# EAGLE design RH001.1 (EAGLE 7.1.0)
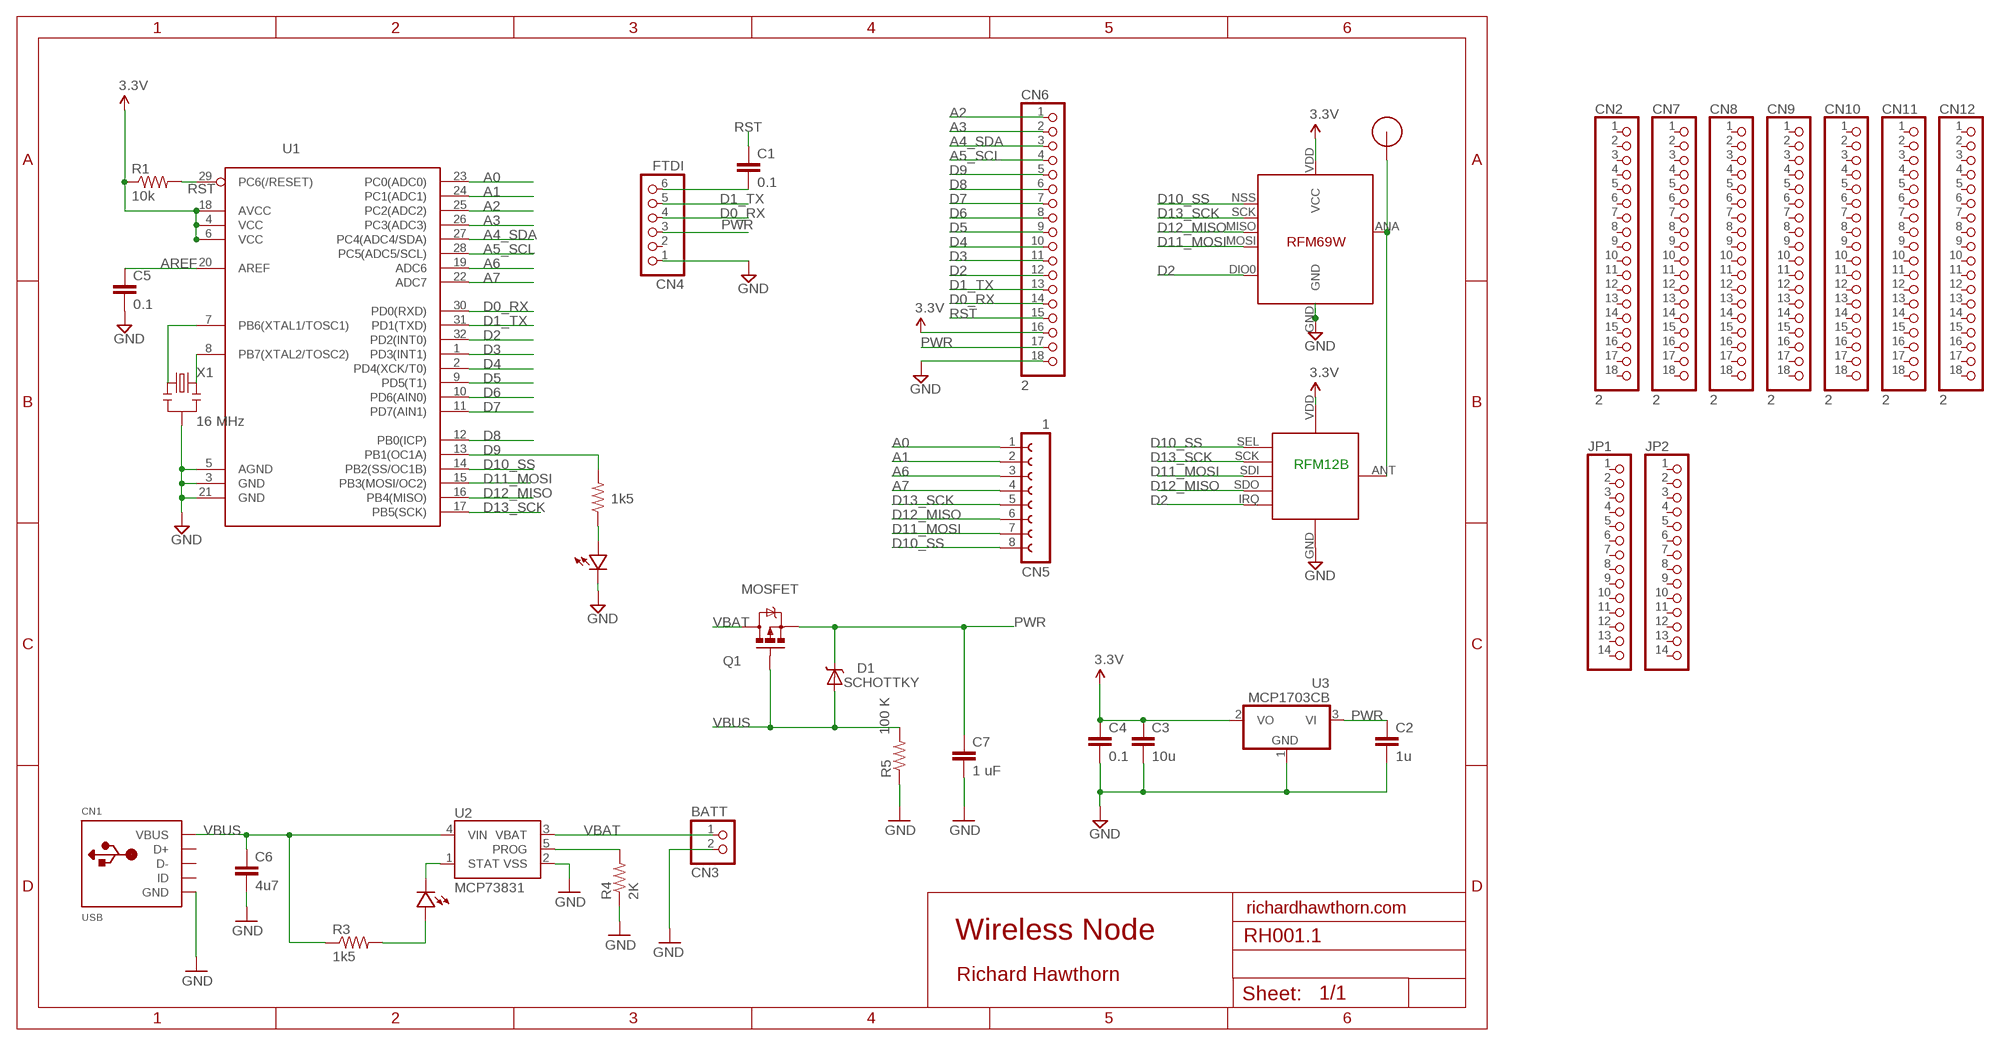
[diagram p0: schematic, sheet 1]

## Parts
C1  0.1  CAP0603-CAP  [0603-CAP]
C2  1u  CAP0603-CAP  [0603-CAP]
C3  10u  CAP0805-CAP  [0805-CAP]
C4  0.1  CAP0603-CAP  [0603-CAP]
C5  0.1  CAP0603-CAP  [0603-CAP]
C6  4u7  CAP0603-CAP  [0603-CAP]
C7  1 uF  CAP0805  [0805]
CN1  USB  USBMINIB  [USB-MINIB]
CN2  2  PINHD-1X18  [1X18]
CN3  BATT  JST_2PIN-SMT-RA  [JST-PH-2-SMT-RA]
CN4  FTDI  PINHD-1X6  [1X06]
CN5  1  FE08-1  [FE08]
CN6  2  PINHD-1X18  [1X18]
CN7  2  PINHD-1X18  [1X18]
CN8  2  PINHD-1X18  [1X18]
CN9  2  PINHD-1X18  [1X18]
CN10  2  PINHD-1X18  [1X18]
CN11  2  PINHD-1X18  [1X18]
CN12  2  PINHD-1X18  [1X18]
D1  SCHOTTKY  DIODE-SCHOTTKY_  [SMA-DIODE]
JP1  PINHD-1X14  [1X14]
JP2  PINHD-1X14  [1X14]
LED1  LED0603  [0603-LED]
LED2  LED0603  [0603-LED]
Q1  MOSFET  MOSFET-PCHANNELSMD  [SOT23-3]
R1  10k  RESISTOR0603-RES  [0603-RES]
R2  1k5  RESISTOR0603-RES  [0603-RES]
R3  1k5  RESISTOR0603-RES  [0603-RES]
R4  2K  RESISTOR0603-RES  [0603-RES]
R5  100 K  RESISTOR0805-RES  [0805]
RF1  RFM12B  RFM12B_MINPADS  [RFM12B-MINPADS]
RF2  RFM69  [RFM69W-MINPADS]
U1  ATMega-328  ATMEGA168/328TQFP32  [TQFP32-08]
U2  MCP73831  [SOT23-5]
U3  MCP1703CB  [SOT23]
U$1  RFM12B_ANTENNA  [RFM12B-ANTENNA]
X1  16 MHz  RESONATORSMD  [RESONATOR-SMD]

## Nets
A0: CN5.1 U1.23(PC0(ADC0))
A1: CN5.2 U1.24(PC1(ADC1))
A2: CN6.1 U1.25(PC2(ADC2))
A3: CN6.2 U1.26(PC3(ADC3))
A4_SDA: CN6.3 U1.27(PC4(ADC4/SDA))
A5_SCL: CN6.4 U1.28(PC5(ADC5/SCL))
A6: CN5.3 U1.19(ADC6)
A7: CN5.4 U1.22(ADC7)
AREF: C5.1 U1.20(AREF)
D0_RX: CN4.4 CN6.14 U1.30(PD0(RXD))
D1_TX: CN4.5 CN6.13 U1.31(PD1(TXD))
D2: CN6.12 RF1.IRQ RF2.DIO0 U1.32(PD2(INT0))
D3: CN6.11 U1.1(PD3(INT1))
D4: CN6.10 U1.2(PD4(XCK/T0))
D5: CN6.9 U1.9(PD5(T1))
D6: CN6.8 U1.10(PD6(AIN0))
D7: CN6.7 U1.11(PD7(AIN1))
D8: CN6.6 U1.12(PB0(ICP))
D9: CN6.5 R2.2 U1.13(PB1(OC1A))
D10_SS: CN5.8 RF1.SEL RF2.NSS(SEL) U1.14(PB2(SS/OC1B))
D11_MOSI: CN5.7 RF1.SDI(SDI/MOSI) RF2.MOSI U1.15(PB3(MOSI/OC2))
D12_MISO: CN5.6 RF1.SDO(SDO/MISO) RF2.MISO U1.16(PB4(MISO))
D13_SCK: CN5.5 RF1.SCK RF2.SCK U1.17(PB5(SCK))
GND [power]: C2.2 C3.2 C4.2 C5.2 C6.2 C7.2 CN1.GND CN3.2 CN4.1 CN6.18 LED2.MINUS R4.1 R5.1 RF1.GND RF2.GND U1.3(GND) U1.5(AGND) U1.21(GND) U2.2(VSS) U3.1(GND) X1.2
N$1: U1.7(PB6(XTAL1/TOSC1)) X1.1
N$2: LED2.PLUS R2.1
N$3: RF1.ANT RF2.ANA(ANT) U$1.P$1
N$4: LED1.PLUS R3.2
N$20: C1.2 CN4.6
N$21: U1.8(PB7(XTAL2/TOSC2)) X1.3
PROG: R4.2 U2.5(PROG)
PWR [power]: C2.1 C7.1 CN4.3 CN6.17 D1.C Q1.2(S) U3.3(VI)
RST: C1.1 CN6.15 R1.2 U1.29(PC6(/RESET))
STAT: LED1.MINUS U2.1(STAT)
VBAT: CN3.1 Q1.3(D) U2.3(VBAT)
VBUS [power]: C6.1 CN1.VBUS D1.A Q1.1(G) R3.1 R5.2 U2.4(VIN)
VCC: C3.1 C4.1 CN6.16 R1.1 RF1.VDD RF2.VDD(VCC) U1.4(VCC) U1.6(VCC) U1.18(AVCC) U3.2(VO) ; supply symbol labelled 3.3V
Unconnected: CN1.D+ CN1.D- CN1.ID CN2.1 CN2.2 CN2.3 CN2.4 CN2.5 CN2.6 CN2.7 CN2.8 CN2.9 CN2.10 CN2.11 CN2.12 CN2.13 CN2.14 CN2.15 CN2.16 CN2.17 CN2.18 CN4.2 CN7.1 CN7.2 CN7.3 CN7.4 CN7.5 CN7.6 CN7.7 CN7.8 CN7.9 CN7.10 CN7.11 CN7.12 CN7.13 CN7.14 CN7.15 CN7.16 CN7.17 CN7.18 CN8.1 CN8.2 CN8.3 CN8.4 CN8.5 CN8.6 CN8.7 CN8.8 CN8.9 CN8.10 CN8.11 CN8.12 CN8.13 CN8.14 CN8.15 CN8.16 CN8.17 CN8.18 CN9.1 CN9.2 CN9.3 CN9.4 CN9.5 CN9.6 CN9.7 CN9.8 CN9.9 CN9.10 CN9.11 CN9.12 CN9.13 CN9.14 CN9.15 CN9.16 CN9.17 CN9.18 CN10.1 CN10.2 CN10.3 CN10.4 CN10.5 CN10.6 CN10.7 CN10.8 CN10.9 CN10.10 CN10.11 CN10.12 CN10.13 CN10.14 CN10.15 CN10.16 CN10.17 CN10.18 CN11.1 CN11.2 CN11.3 CN11.4 CN11.5 CN11.6 CN11.7 CN11.8 CN11.9 CN11.10 CN11.11 CN11.12 CN11.13 CN11.14 CN11.15 CN11.16 CN11.17 CN11.18 CN12.1 CN12.2 CN12.3 CN12.4 CN12.5 CN12.6 CN12.7 CN12.8 CN12.9 CN12.10 CN12.11 CN12.12 CN12.13 CN12.14 CN12.15 CN12.16 CN12.17 CN12.18 JP1.1 JP1.2 JP1.3 JP1.4 JP1.5 JP1.6 JP1.7 JP1.8 JP1.9 JP1.10 JP1.11 JP1.12 JP1.13 JP1.14 JP2.1 JP2.2 JP2.3 JP2.4 JP2.5 JP2.6 JP2.7 JP2.8 JP2.9 JP2.10 JP2.11 JP2.12 JP2.13 JP2.14

## Notes on the sheet
- RFM12B
- richardhawthorn.com
- Wireless Node
- Richard Hawthorn

## Library data of the parts
C1-C5 = LowPowerLab:CAP: Capacitor Standard 0603 ceramic capacitor, and 0.1" leaded capacitor.
C6 = SparkFun:CAP: Capacitor Standard 0603 ceramic capacitor, and 0.1" leaded capacitor.
C7 = SparkFun-Capacitors:CAP: Capacitor Standard 0603 ceramic capacitor, and 0.1" leaded capacitor.
CN1 = LowPowerLab:USB: USB Connectors USBMINIB - Surface Mount Female Mini-B USB Connector 4UConnector: 06564 By microbuilder.eu Thru-hole RA Female Mini-B USB Connector 4UConnector: 18732 By ladyada.net
CN2 CN6-CN12 = pinhead:PINHD-1X18: PIN HEADER
CN3 = adafruit:JST_2PIN: JST 2-Pin Connectors of various flavors SMT-RA (S2B-PH-SM4) 4UConnector #17311 SMT (B2B-PH-SM4) THM-RA (S2B-PH) THM (B2B-PH)
CN4 = pinhead:PINHD-1X6: PIN HEADER
CN5 = con-lsta:FE08-1: FEMALE HEADER; OC_FARNELL: unknown; OC_NEWARK: unknown
D1 = SparkFun-DiscreteSemi:DIODE-SCHOTTKY: Commonly MBRA140.
JP1 JP2 = pinhead:PINHD-1X14: PIN HEADER
LED1 LED2 = LowPowerLab:LED
Q1 = SparkFun-DiscreteSemi:MOSFET-PCHANNEL: Generic PMOSFET
R1-R4 = LowPowerLab:RESISTOR: Resistor Basic schematic elements and footprints for 0603, 1206, and PTH resistors.
R5 = SparkFun-Resistors:RESISTOR: Resistor Basic schematic elements and footprints for 0603, 1206, and PTH resistors.
RF1 = LowPowerLab:RFM12B_MINPADS
RF2 = LowPowerLab:RFM69
U1 = LowPowerLab:ATMEGA168/328: Atmel 32-pin 8-bit micro, 16k flash.
U2 = SparkFun:MCP73831: Microchip's MCP73831 Miniature single cell, fully integrated Li-Ion, Li-polymer charge management controller http://ww1.microchip.com/downloads/en/DeviceDoc/21984a.pdf
U3 = linear:MCP1703: 250 mA, 16V, Low Quiescent Current LDO Regulator Source: http://ww1.microchip.com/downloads/en/DeviceDoc/22049b.pdf
U$1 = LowPowerLab:RFM12B_ANTENNA
X1 = SparkFun:RESONATOR: Resonator Small SMD resonator. This is the itty bitty 10/20MHz resonators with built in caps. CSTCE10M0G55 and CSTCE20M0V53. Footprint has been reviewed closely but hasn't been tested yet.

## Net classes
1 power: width 0.381 mm, clearance 0.254 mm

## Board
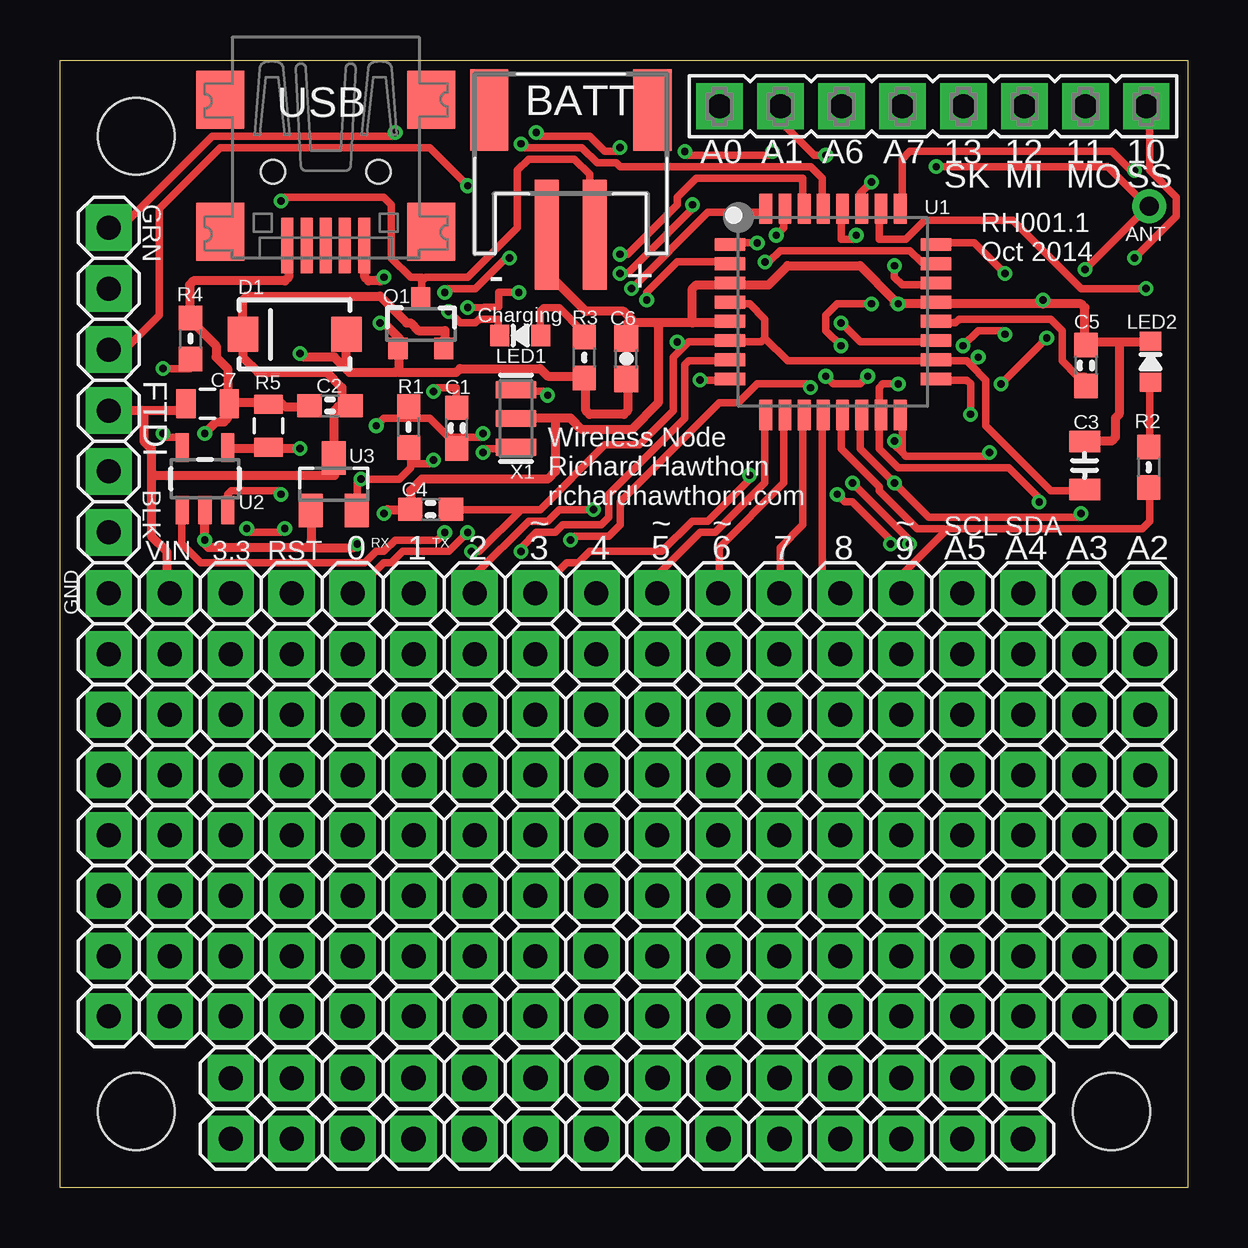
[diagram p1: board, top side]
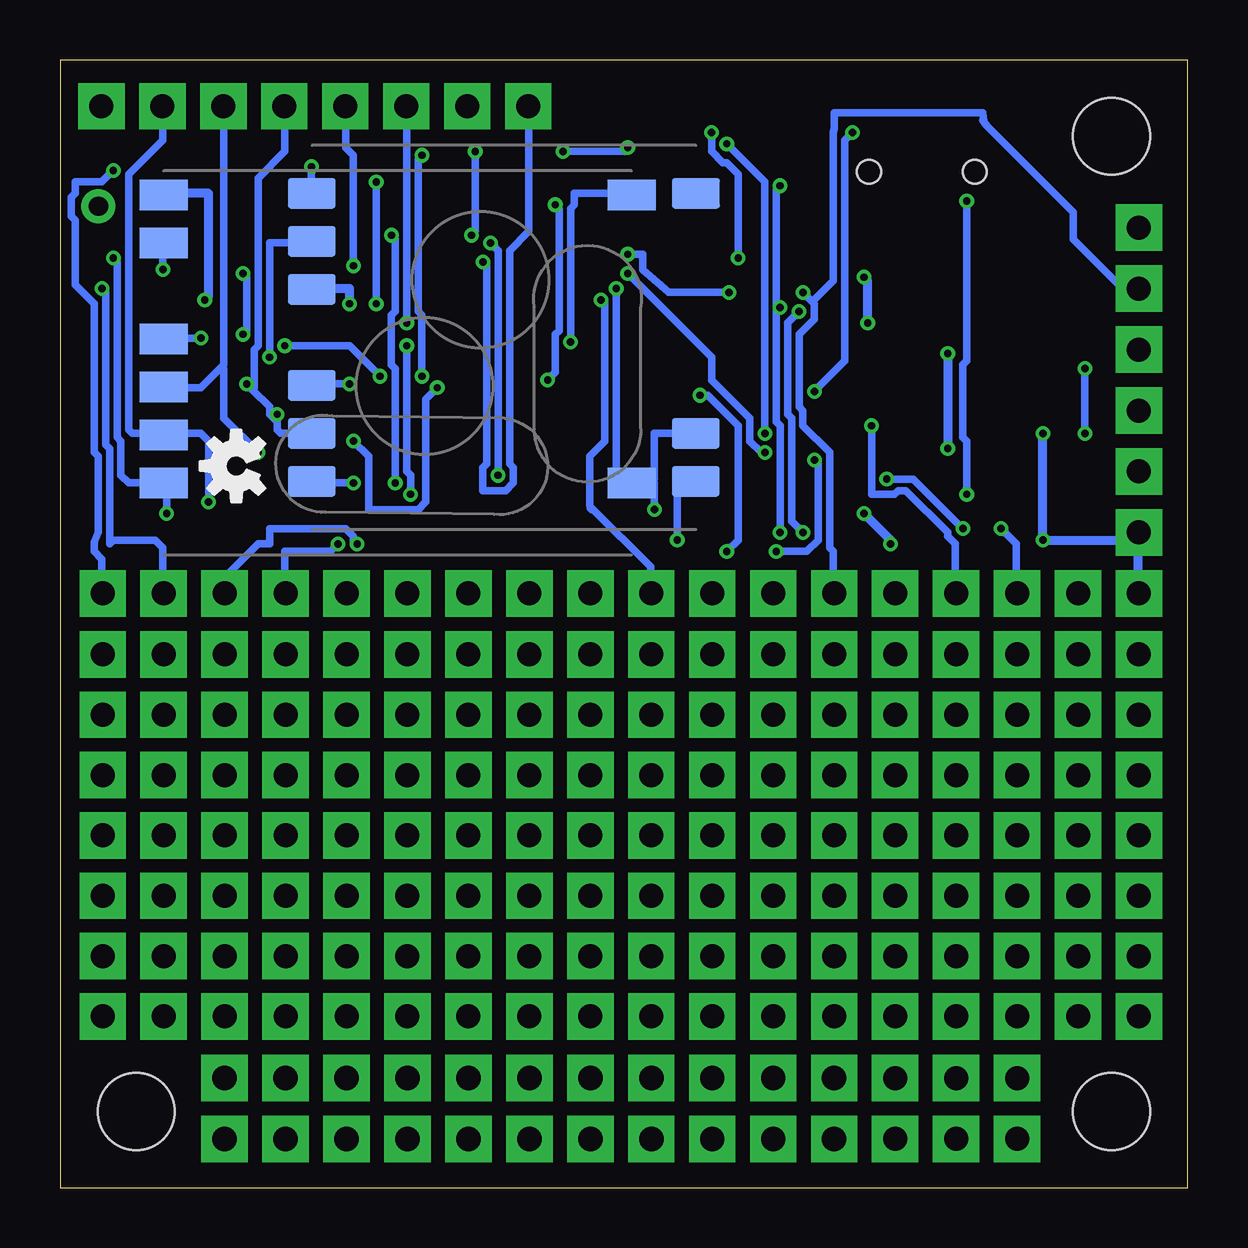
[diagram p2: board, bottom side, seen from below]

Size 46.99 x 46.99 mm. Coordinates in mm from the lower left corner, seen from the top.
Outline: 0,0 0,46.99 46.99,46.99 46.99,0 0,0
Copper layers (1*16): Top 0.035mm / dielectric 1.5mm / Bottom 0.035mm
Design rules "ITEADstudio_DRC *": minimum track width 12mil, minimum drill 12mil, track to track 6mil, track to pad 6mil, pad to pad 6mil, via to via 6mil, smd to smd 0mil, copper to edge 10mil, drill to drill 10mil, minimum pad ring 10mil, minimum via ring 6mil, stop-mask expansion 2mil, vias tented up to drill 100mil, thermal gap 15mil
Holes 3.2 mm at 3.18,3.18 43.81,3.18 3.18,43.81
tRestrict: area 23,7.6 to 27.8,11.6; area 4.6,15.6 to 5.6,17.3; area 3.9,8.4 to 5.5,9.1
bRestrict: area 26.2,16.4 to 27.9,17.4; area 19.8,12.6 to 21.6,13.6; area 20.3,11.3 to 20.8,11.9; area 19.4,11.3 to 19.9,11.9; area 18.9,11.6 to 19.4,12.2; area 18.8,12.1 to 19.4,12.8; area 25.3,17.6 to 25.8,18.2; area 25.3,16.6 to 25.8,17.2; area 26.3,17.9 to 26.8,18.5; area 26.7,17.6 to 27.8,18.3

### Footprints (pad centres in the part's own frame; a part is rotated, then mirrored left to right if it is on the bottom)
0603-CAP = smd 1.016 x 0.965: 1 -0.85,0; 2 0.85,0
0805-CAP = smd 0.902 x 1.3: 1 -1,0; 2 1,0
0603-CAP' = smd 1.1 x 1: 1 -0.85,0; 2 0.85,0
0805 = smd 0.8 x 1.2: 1 -0.9,0; 2 0.9,0
USB-MINIB = smd 0.5 x 2.308: D+ 0,4.064; D- -0.8,4.064; GND 1.6,4.064; ID 0.8,4.064; VBUS -1.6,4.064 | smd 2 x 2.4: GND1 -4.4,-2; GND2 -4.4,3.5; GND3 4.4,3.5; GND4 4.4,-2 | hole 1: -2.2,1; 2.2,1
1X18 = drill 1 pad 1.93 square: 1 -21.59,0; 2 -19.05,0; 3 -16.51,0; 4 -13.97,0; 5 -11.43,0; 6 -8.89,0; 7 -6.35,0; 8 -3.81,0; 9 -1.27,0; 10 1.27,0; 11 3.81,0; 12 6.35,0; 13 8.89,0; 14 11.43,0; 15 13.97,0; 16 16.51,0; 17 19.05,0; 18 21.59,0
JST-PH-2-SMT-RA = smd 1 x 4.6: 1 1,-3.7; 2 -1,-3.7 | smd 1.6 x 3.4: NC1 -3.4,1.5; NC2 3.4,1.5
1X06 = drill 1 pad 1.93 square: 1 -6.35,0; 2 -3.81,0; 3 -1.27,0; 4 1.27,0; 5 3.81,0; 6 6.35,0
FE08 = drill 1 pad 1.93 square: 1 -8.89,0; 2 -6.35,0; 3 -3.81,0; 4 -1.27,0; 5 1.27,0; 6 3.81,0; 7 6.35,0; 8 8.89,0
SMA-DIODE = smd 1.27 x 1.47: A -2.15,0; C 2.15,0
1X14 = drill 1 pad 1.93 square: 1 -16.51,0; 2 -13.97,0; 3 -11.43,0 | drill 1.016 pad 1.93 square: 4 -8.89,0; 5 -6.35,0; 6 -3.81,0; 7 -1.27,0; 8 1.27,0; 9 3.81,0; 10 6.35,0; 11 8.89,0; 12 11.43,0; 13 13.97,0; 14 16.51,0
0603-LED = smd 0.8 x 0.9: MINUS -0.85,0; PLUS 0.85,0
SOT23-3 = smd 0.8 x 0.9: 1 -0.95,-1; 2 0.95,-1; 3 0,1.1
0603-RES = smd 1.016 x 0.965: 1 -0.85,0; 2 0.85,0
RFM12B-MINPADS = smd 2 x 1.27: ANT 8,-6; GND 8,-2; IRQ -8,4; SCK 8,4; SDI 8,2; SDI1 -8.002,-6.001; SDO -8,6; SEL 8,6; VDD 8,-4
RFM69W-MINPADS = smd 2 x 1.27: ANA 8,-5; DIO0 -11.5,5; GND 8,-7; MISO 8,1; MOSI 8,3; NSS 8,5; SCK 8,-1; VDD -11.5,-7
TQFP32-08 = smd 1.27 x 0.533: 1 -4.293,2.8; 2 -4.293,2; 3 -4.293,1.2; 4 -4.293,0.4; 5 -4.293,-0.4; 6 -4.293,-1.2; 7 -4.293,-2; 8 -4.293,-2.8; 17 4.293,-2.8; 18 4.293,-2; 19 4.293,-1.2; 20 4.293,-0.4; 21 4.293,0.4; 22 4.293,1.2; 23 4.293,2; 24 4.293,2.8 | smd 0.533 x 1.27: 9 -2.8,-4.293; 10 -2,-4.293; 11 -1.2,-4.293; 12 -0.4,-4.293; 13 0.4,-4.293; 14 1.2,-4.293; 15 2,-4.293; 16 2.8,-4.293; 25 2.8,4.293; 26 2,4.293; 27 1.2,4.293; 28 0.4,4.293; 29 -0.4,4.293; 30 -1.2,4.293; 31 -2,4.293; 32 -2.8,4.293
SOT23-5 = smd 0.55 x 1.2: 1 -0.95,-1.3; 2 0,-1.3; 3 0.95,-1.3; 4 0.95,1.3; 5 -0.95,1.3
SOT23 = smd 1 x 1.4: 1 -0.95,-1.1; 2 0.95,-1.1; 3 0,1.1
RFM12B-ANTENNA = drill 0.8 pad 1.422: P$1 0,0
RESONATOR-SMD = smd 0.7 x 1.7: 1 -1.2,0; 2 0,0; 3 1.2,0

### Placement (x,y rotation side)
C1  16.54,31.65 90 top
C2  11.25,32.59 180 top
C3  42.7,30.1 90 top
C4  15.44,28.27 180 top
C5  42.75,34.26 90 top
C6  4u7  [0603-CAP']  23.6,34.54 90 top
C7  6.15,32.66 0 top
CN1  11.07,43.33 180 top
CN2  23.62,22.23 0 top
CN3  21.29,43.41 0 top
CN4  2.03,33.65 90 top
CN5  36.37,45.06 0 top
CN6  23.62,24.77 180 top
CN7  23.62,19.71 0 top
CN8  23.62,17.2 0 top
CN9  23.62,14.68 0 top
CN10  23.62,12.17 0 top
CN11  23.62,9.65 0 top
CN12  23.62,7.14 0 top
D1  9.78,35.56 180 top
JP1  23.62,4.57 0 top
JP2  23.62,2.03 0 top
LED1  19.18,35.51 0 top
LED2  45.44,34.42 270 top
Q1  15.04,35.97 0 top
R1  14.53,31.7 90 top
R2  45.36,30.02 270 top
R3  21.84,34.59 90 top
R4  5.44,35.38 270 top
R5  8.69,31.75 270 top
RF1  28.5,35.43 180 bottom
RF2  34.67,34.37 180 bottom
U1  32.21,36.5 0 top
U2  6.05,29.54 0 top
U3  11.4,29.31 0 top
U$1  45.39,40.89 0 top
U$3  [OSHW-LOGO-S]  39.65,30.07 90 bottom
X1  19,32.05 270 top

### Tracks (layer width: path | path; a pad name or v marks a point on that pad's centre or on a via)
A0  (via drill 0.3)
  Top 0.305: v29.37,38.58 29.53,38.58 30,39.05 35.4,39.05 35.88,38.58 36.35,38.58 U1.23
  Bottom 0.305: v29.37,38.58 29.21,38.42 29.21,30.16 29.37,30 29.37,29.05 28.42,29.05 28.1,29.37 28.1,30 28.26,30.16 28.26,39.05 27.46,39.85 27.46,44.93 CN5.1
A1  (via drill 0.3)
  Top 0.305: v31.91,43.02 31.43,43.02 30.16,44.29 30.16,44.93 CN5.2 | v31.91,33.81 32.23,33.5 33.34,33.5 v33.65,33.81 | v37.62,35.08 38.26,35.72 39.21,35.72 v39.37,35.56 | v39.37,38.1 38.1,39.37 36.51,39.37 U1.24
  Bottom 0.305: v31.91,43.02 32.07,42.86 32.07,36.51 31.91,36.35 v31.91,33.81 | v33.65,33.81 34.92,35.08 v37.62,35.08 | v39.37,35.56 39.21,35.72 39.21,37.94 v39.37,38.1
A2  (via drill 0.3)
  Top 0.305: v44.77,42.39 44.61,42.39 43.81,43.18 35.4,43.18 35.08,42.86 35.08,40.8 U1.25
  Bottom 0.305: v44.77,42.39 45.24,41.91 46.35,41.91 46.35,41.43 46.51,41.27 46.51,40.48 46.35,40.32 46.35,37.62 45.56,36.83 45.56,30.64 45.4,30.48 45.4,27.3 45.56,26.89 45.56,26.51 45.24,26.19 45.24,24.77 CN6.1
A3  (via drill 0.3)
  Top 0.305: v45.24,37.46 42.54,37.46 39.69,40.32 36.04,40.32 35.24,39.53 34.13,39.53 34.13,40.64 U1.26
  Bottom 0.305: v45.24,37.46 45.08,37.31 45.08,30.96 44.93,30.8 44.93,26.83 44.77,26.99 43.02,26.99 42.7,26.67 42.7,24.77 CN6.2
A4_SDA  (via drill 0.3)
  Top 0.305: v33.81,41.91 33.34,41.43 33.34,40.8 U1.27 | v33.81,36.83 32.38,36.83 31.91,36.35 31.91,35.72 v32.54,35.08 | v32.38,28.89 32.7,28.57 33.02,28.57 34.61,26.99 v34.61,26.83
  Bottom 0.305: v33.81,36.83 v33.81,41.91 | v32.54,35.08 32.54,29.84 32.38,29.69 v32.38,28.89 | v34.61,26.83 34.77,26.99 34.77,27.15 35.08,27.46 38.26,27.46 38.26,26.83 38.73,26.83 40,25.56 40,24.77 CN6.3
A5_SCL  (via drill 0.3)
  Top 0.305: v33.18,39.69 33.02,39.53 32.54,39.53 32.54,40.64 U1.28 | v33.02,29.37 35.4,26.99 v35.4,26.83
  Bottom 0.305: v33.18,39.69 33.02,39.53 33.02,36.51 33.18,36.35 33.18,34.29 33.02,34.13 v33.02,29.37 | v35.4,26.83 35.72,26.51 37.62,26.51 37.62,24.77 CN6.4
A6  (via drill 0.3)
  Top 0.305: v32.54,36.04 33.34,35.24 36.35,35.24 U1.19
  Bottom 0.305: v32.54,36.04 32.54,44.93 CN5.3
A7  (via drill 0.3)
  Top 0.305: v34.77,38.42 34.77,37.94 35.08,37.62 36.35,37.62 U1.22
  Bottom 0.305: v34.77,38.42 34.77,43.02 35.08,43.34 35.08,44.93 CN5.4
AREF
  Top 0.305: C5.1 42.7,33.5 42.7,33.81 42.39,33.81 41.75,34.45 41.75,35.72 41.27,36.2 37.46,36.2 37.31,36.04 36.51,36.04 U1.20
D0_RX  (via drill 0.3)
  Top 0.305: v23.34,38.89 23.65,38.89 25.72,40.96 25.72,41.27 26.51,42.07 30.96,42.07 30.96,40.8 U1.30 | v16.99,36.67 18.29,36.7 18.29,37.31 v19.11,37.31 | v16.99,27.3 16.19,26.51 14.29,26.51 13.81,26.04 13.49,26.04 12.22,24.77 CN6.14 | CN4.4 2.7,34.92 4.13,36.35 4.13,40.8 6.67,43.34 15.4,43.34 v16.99,41.75
  Bottom 0.305: v23.34,38.89 22.7,38.89 22.7,38.26 21.62,37.31 v19.11,37.31 | v16.99,27.3 16.99,31.75 17.14,31.91 17.14,36.51 v16.99,36.67 17.14,36.67 17.14,41.59 v16.99,41.75
D1_TX  (via drill 0.3)
  Top 0.305: v29.84,39.69 30.16,40 30.16,40.64 U1.31 | v29.69,43.18 29.53,43.02 26.19,43.02 v26.04,43.18 | v23.34,43.34 23.18,43.18 22.7,43.18 22.07,43.81 20,43.81 v19.84,43.97 | v18.73,38.73 18.57,38.73 17.3,37.46 16.19,37.46 v16.03,37.31
  Bottom 0.305: v29.84,39.69 29.69,39.85 v29.69,43.18 | v26.04,43.18 23.34,43.18 v23.34,43.34 | v19.84,43.97 19.84,43.18 19.37,42.7 19.21,42.7 18.73,42.23 v18.73,38.73 | 15.64,36.91 15.56,36.83 15.56,36.2 16.19,35.56 16.19,32.54 16.03,32.38 16.03,31.75 14.92,30.64 14.92,26.67 14.76,26.51 14.76,24.77 CN6.13 | 15.64,36.91 v16.03,37.31 | CN4.5 2.7,37.46 4.76,39.53 4.76,40.64 8.38,44.26 8.54,44.48 8.51,44.45 8.54,44.8 14.73,44.8 14.73,44.13 14.76,43.97 14.76,37.78 15.64,36.91
D2  (via drill 0.3)
  Top 0.305: v23.81,37.46 26.99,40.64 29.37,40.64 U1.32 | v22.23,28.26 20.8,28.26 20.32,27.78 19.53,27.78 17.3,25.56 17.3,24.77 CN6.12
  Bottom 0.305: v23.81,37.46 23.81,29.53 23.65,29.37 RF2.DIO0 | RF1.IRQ 20.64,31.43 22.23,31.43 22.23,29.53 22.38,29.37 23.02,29.37 RF2.DIO0 | v22.23,28.26 22.23,29.37 RF2.DIO0
D3  (via drill 0.3)
  Top 0.305: v29.05,39.37 27.94,39.37 U1.1 | v28.73,29.69 28.73,29.53 26.99,27.78 26.35,27.78 25.08,26.51 22.07,26.51 21.59,26.04 21.11,26.04 19.84,24.77 CN6.11
  Bottom 0.305: v29.05,39.37 28.73,39.05 v28.73,29.69
D4  (via drill 0.3)
  Top 0.305: v24.45,36.99 24.45,37.31 25.72,38.58 27.78,38.58 U1.2
  Bottom 0.305: v24.45,36.99 24.29,36.83 24.29,31.11 24.92,30.48 24.92,28.45 24.89,28.32 24.83,28.26 24.83,28.32 22.38,25.88 22.38,24.77 CN6.10
D5
  Top 0.305: U1.9 29.37,32.07 29.37,29.37 27.3,27.3 26.67,27.3 24.92,25.56 24.92,24.77 CN6.9
D6
  Top 0.305: U1.10 30.16,32.07 30.16,29.37 27.46,26.67 27.46,24.77 CN6.8
D7
  Top 0.305: U1.11 30.96,32.07 30.96,27.62 30,26.67 30,24.77 CN6.7
D8
  Top 0.305: U1.12 31.75,32.07 31.75,25.4 32.38,24.77 CN6.6
D9
  Top 0.305: 36.91,27.38 35.08,25.56 35.08,24.77 CN6.5 | 36.91,27.38 36.99,27.46 45.08,27.46 45.4,27.78 45.4,29.05 R2.2 | U1.13 32.54,32.07 32.54,30.8 34.13,29.21 34.13,29.05 35.72,27.46 36.83,27.46 36.91,27.38
D10_SS  (via drill 0.3)
  Top 0.305: U1.14 33.34,32.07 33.34,30.8 v34.77,29.37 36.2,27.94 42.39,27.94 v42.54,28.1 | v44.77,38.73 46.51,40.48 46.51,41.27 45.4,42.39 45.4,44.93 CN5.8
  Bottom 0.305: v34.77,29.37 36.35,29.37 RF1.SEL | v42.54,28.1 42.54,29.21 RF2.NSS 42.7,29.37 44.13,29.37 44.45,29.69 44.45,31.11 44.61,31.27 44.61,38.58 v44.77,38.73
D11_MOSI  (via drill 0.3)
  Top 0.305: v34.92,33.5 34.29,33.5 34.13,33.34 34.13,32.23 U1.15 34.13,32.07 34.13,30.8 34.92,30 39.53,30 40.8,28.73 v40.8,28.57
  Bottom 0.305: v34.92,33.5 36.35,33.5 RF1.SDI | CN5.7 42.7,44.93 42.7,43.66 44.13,42.23 44.13,31.59 43.97,31.43 42.7,31.43 RF2.MOSI 42.54,31.43 41.12,31.43 40.8,31.11 v40.8,28.57
D12_MISO  (via drill 0.3)
  Top 0.305: 35.08,30.64 35.08,32.07 U1.16 | 35.08,30.64 35.24,30.48 38.58,30.48 v38.73,30.64 | v21.27,26.99 21.43,27.15 22.86,27.15 23.34,27.62 23.34,28.57 27.46,32.7 28.26,32.7 29.05,33.5 31.11,33.5 v31.27,33.34 | v34.77,31.11 34.77,30.96 35.08,30.64
  Bottom 0.305: 40.24,34.21 41.12,33.34 42.54,33.34 RF2.MISO | 40.24,34.21 40.16,34.29 40.16,44.93 CN5.6 | v38.73,30.64 40.16,32.07 40.16,34.13 40.24,34.21 | v21.27,26.99 21.27,29.37 20.64,29.37 RF1.SDO | v31.27,33.34 31.75,32.86 31.75,28.57 32.07,28.26 34.13,28.26 34.13,30.48 v34.77,31.11
D13_SCK  (via drill 0.3)
  Top 0.305: v37.94,32.23 37.94,33.5 37.78,33.65 36.51,33.65 U1.17 | v39.21,33.5 v41.12,35.4
  Bottom 0.305: 37.94,31.91 37.94,31.59 37.78,31.43 36.51,31.43 RF1.SCK | 37.94,31.91 v37.94,32.23 | v41.12,35.4 42.54,35.4 RF2.SCK | 38.97,33.26 38.26,32.54 38.26,32.23 37.94,31.91 | 38.97,33.26 v39.21,33.5 | CN5.5 37.62,44.93 37.62,43.18 38.73,42.07 38.73,35.08 38.89,34.92 38.89,33.34 38.97,33.26
GND  (via drill 0.3)
  Top 0.381: 44.13,35.24 42.86,35.24 C5.2 42.7,35.24 42.7,36.67 42.54,36.83 40.96,36.83 | 44.13,35.24 45.4,35.24 LED2.MINUS | 40.96,36.83 36.51,36.83 U1.21 36.35,36.83 v34.92,36.83 34.77,36.83 34.77,36.99 33.34,38.42 30.32,38.42 29.53,37.62 27.94,37.62 U1.3 27.78,37.62 26.51,37.62 26.35,37.46 26.35,36.04 | 44.13,35.24 44.13,32.23 43.97,32.07 43.97,31.27 43.81,31.11 42.7,31.11 C3.2 | v40.96,36.99 40.96,36.83 | C2.2 10.32,32.54 9.37,32.54 9.21,32.7 8.73,32.7 R5.1 8.57,32.7 7.14,32.7 C7.2 | CN1.GND 9.53,39.21 9.53,37.94 9.37,37.78 5.56,37.78 5.4,37.62 5.4,36.35 R4.1 5.4,36.2 5.4,36.04 5.56,36.04 6.51,35.08 6.51,34.61 6.99,34.13 6.99,32.7 C7.2 | v13.49,28.1 13.65,28.26 14.45,28.26 C4.2 14.61,28.42 14.61,29.05 15.08,29.53 20.32,29.53 20.64,29.84 20.64,32.07 | v12.38,26.83 12.22,26.67 10.64,26.67 | 10.64,26.67 10.48,26.83 10.48,28.1 U3.1 | 10.64,26.67 6.19,26.67 6.03,26.83 v6.03,26.99 6.03,28.1 U2.2 | 26.35,36.04 27.78,36.04 U1.5 | 26.35,36.04 24.92,36.04 | 24.92,36.04 23.81,36.04 | 23.81,36.04 23.65,36.04 23.65,35.4 C6.2 | 20.64,32.07 21.27,32.07 21.75,31.59 23.81,31.59 24.92,32.7 24.92,36.04 | 20.64,32.07 19.05,32.07 X1.2 | CN3.2 20.32,39.69 20.32,38.1 21.91,36.51 23.5,36.51 23.81,36.2 23.81,36.04 | v6.03,31.43 6.51,31.91 6.83,31.91 6.99,32.07 6.99,32.54 C7.2
  Bottom 0.381: 42.7,41.43 RF2.GND 42.54,41.43 40.8,41.43 40.8,37.15 v40.96,36.99 | v34.92,36.83 34.92,37.46 36.35,37.46 RF1.GND | CN6.18 2.06,24.77 2.06,27.3 CN4.1 2.22,26.99 v6.03,26.99 v6.03,31.43 | v13.49,28.1 12.38,26.99 v12.38,26.83
N$1  (via drill 0.3)
  Top 0.305: v19.21,26.51 19.21,26.67 19.84,27.3 20.64,27.3 20.96,27.62 22.54,27.62 22.86,27.94 22.86,28.89 26.04,32.07 26.04,34.29 26.19,34.45 27.78,34.45 U1.7 | v20.32,33.02 20.16,33.18 19.05,33.18 X1.1
  Bottom 0.305: v19.21,26.51 18.73,26.99 18.73,31.75 20,33.02 v20.32,33.02
N$2
  Top 0.305: LED2.PLUS 45.4,33.5 45.27,33.5 45.4,33.31 45.4,30.96 R2.1
N$3  (via drill 0.3)
  Top 0.305: v36.51,42.54 43.66,42.54 45.24,40.96 U$1.P$1 45.24,40.8 v42.7,38.26
  Bottom 0.305: v36.51,42.54 36.51,41.43 RF1.ANT | v42.7,38.26 42.7,39.21 RF2.ANA
N$4
  Top 0.305: LED1.PLUS 20,35.56 20,36.51 20.16,36.67 20.8,36.67 21.75,35.72 21.91,35.72 21.91,35.56 R3.2
N$20  (via drill 0.3)
  Top 0.305: v15.56,33.18 15.72,33.34 16.51,33.34 16.51,32.54 C1.2 | v13.97,43.97 13.81,43.81 6.35,43.81 2.54,40 CN4.6
  Bottom 0.305: v15.56,33.18 14.29,34.45 14.29,43.66 v13.97,43.97
N$21  (via drill 0.3)
  Top 0.305: v26.67,33.65 27.78,33.65 U1.8 | v26.35,40.96 26.35,40.8 23.65,38.1 v23.34,38.1 | v17.62,30.64 17.78,30.8 18.89,30.8 X1.3
  Bottom 0.305: v26.67,33.65 26.35,33.97 26.35,35.56 26.19,35.72 26.19,40.8 v26.35,40.96 | v23.34,38.1 19.84,34.61 19.84,33.65 18.26,32.07 18.26,31.11 17.78,30.64 v17.62,30.64
PROG  (via drill 0.3)
  Top 0.305: v4.29,34.13 5.4,34.13 5.4,34.45 R4.2 | v4.29,31.43 4.45,31.27 5.08,31.27 5.08,30.96 U2.5
  Bottom 0.305: v4.29,31.43 v4.29,34.13
PWR
  Top 0.381: Q1.2 16.03,35.08 16.03,35.72 14.92,35.72 14.61,36.04 14.45,36.04 13.34,37.15 7.78,37.15 7.62,36.99 D1.C 7.62,35.4 7.62,34.61 8.26,33.97 11.11,33.97 11.75,33.34 11.75,32.7 C2.1 12.07,32.54 11.59,32.54 11.43,32.38 11.43,30.48 U3.3 11.43,30.32 11.43,29.69 3.81,29.69 | 3.49,32.38 5.24,32.38 5.4,32.54 C7.1 | 3.49,32.38 CN4.3 | 3.81,29.69 3.81,30.8 3.49,31.11 3.49,32.38 | 3.81,29.69 3.81,27.15 4.45,26.51 4.45,24.77 CN6.17
RST  (via drill 0.3)
  Top 0.305: v19.21,43.5 19.37,43.34 21.75,43.34 22.38,42.7 23.18,42.7 23.34,42.54 31.27,42.54 31.75,42.07 31.75,40.8 U1.29 | v17.62,31.43 17.46,31.27 16.35,31.27 C1.1 16.51,30.96 15.4,32.07 14.76,32.07 14.61,32.23 14.61,32.54 R1.2 14.61,32.07 13.49,32.07 v13.18,31.75
  Bottom 0.305: v19.21,43.5 17.62,41.91 v17.62,31.43 | v13.18,31.75 13.18,28.89 12.22,28.89 12.07,29.05 11.75,29.05 10,27.3 10,27.15 9.68,26.83 9.68,24.77 CN6.15
STAT  (via drill 0.3)
  Top 0.305: v16.19,36.51 16.67,36.04 17.3,36.04 17.46,36.2 18.26,36.2 18.26,35.56 LED1.MINUS | v16.03,27.3 15.72,26.99 13.97,26.99 13.49,26.51 13.18,26.51 12.7,26.04 5.87,26.04 5.08,26.83 5.08,28.1 U2.1
  Bottom 0.305: v16.19,36.51 16.67,36.04 16.67,32.23 16.51,32.07 16.51,27.78 v16.03,27.3
VBAT  (via drill 0.3)
  Top 0.305: 15.16,37.86 15.24,37.94 16.99,37.94 19.05,40 19.05,42.39 19.53,42.86 21.43,42.86 22.07,42.23 22.07,41.59 22.23,41.43 22.23,39.85 CN3.1 | 15.16,37.86 15.08,37.78 15.08,37.15 Q1.3 | v9.21,28.89 9.05,29.05 7.14,29.05 6.99,28.89 6.99,28.26 U2.3 | v9.21,41.12 9.37,41.27 13.49,41.27 13.81,40.96 13.81,38.73 14.61,37.94 15.08,37.94 15.16,37.86
  Bottom 0.305: v9.21,28.89 9.21,31.11 9.37,31.27 9.37,34.29 9.21,34.45 v9.21,41.12
VBUS  (via drill 0.3)
  Top 0.381: C6.1 23.65,33.65 23.65,32.38 23.5,32.23 22.07,32.23 21.91,32.38 21.91,33.65 R3.1 21.75,33.81 20.32,33.81 20,34.13 16.67,34.13 16.51,33.97 14.13,33.97 14.13,34.13 | U2.4 7.14,30.8 8.57,30.8 R5.2 8.73,30.8 v10,30.8 | 14.13,34.13 14.13,34.92 Q1.1 14.13,35.08 14.13,35.4 13.49,36.04 v13.34,36.04 | 14.13,34.13 13.97,33.97 12.07,33.97 11.91,34.13 11.91,34.29 | 11.91,34.29 11.91,35.56 D1.A | v10,34.77 10.16,34.61 11.43,34.61 11.75,34.29 11.91,34.29 | v13.49,37.94 13.34,37.78 12.86,37.78 12.7,37.94 12.7,39.21 CN1.VBUS
  Bottom 0.381: v10,34.77 v10,30.8 | v13.49,37.94 13.34,37.78 v13.34,36.04
VCC  (via drill 0.3)
  Top 0.305: v7.78,27.46 7.94,27.3 9.21,27.3 v9.37,27.46 | U3.2 12.38,28.26 12.38,29.37 v12.54,29.53 14.13,29.53 14.61,30 14.61,30.16 | 14.61,30.16 14.61,30.8 R1.1 | 19.21,28.26 20,28.26 22.7,30.96 24.13,30.96 25.56,32.38 25.56,34.61 25.96,35 | 19.21,28.26 16.35,28.26 C4.1 | 25.96,35 26.19,35.24 27.78,35.24 U1.6 27.94,35.24 29.21,35.24 29.37,35.4 | 29.37,35.4 29.37,36.2 28.73,36.83 27.94,36.83 U1.4 | 29.37,35.4 30.32,34.45 36.35,34.45 U1.18 36.51,34.45 37.78,34.45 37.94,34.29 | 37.94,34.29 38.58,33.65 38.58,31.75 41.27,29.05 42.54,29.05 C3.1 | 25.96,35 v25.72,35.24 | 37.94,34.29 v38.26,34.61 | 14.61,30.16 15.4,30.16 v15.56,30.32 | v17.14,26.51 17.46,26.51 19.21,28.26
  Bottom 0.305: v7.78,27.46 7.14,26.83 7.14,24.77 CN6.16 | v9.37,27.46 11.43,29.53 v12.54,29.53 | v25.72,35.24 25.72,40.8 25.56,40.96 25.56,41.43 23.18,41.43 RF2.VDD | v38.26,34.61 38.26,39.37 36.51,39.37 RF1.VDD | v15.56,30.32 15.4,30.16 15.4,26.99 15.88,26.51 v17.14,26.51

### Text on the board
tNames: A0 | A1 | A6 | A7 | 13 | 12 | 11 | 10 | SK | MI | MO | SS | GRN | ANT | RH001.1 / Oct 2014 | Charging | FTDI | BLK | Wireless Node / Richard Hawthorn / richardhawthorn.com | RX | TX | ~ | ~ | ~ | ~ | SCL | SDA | VIN | 3.3 | RST | 0 | 1 | 2 | 3 | 4 | 5 | 6 | 7 | 8 | 9 | A5 | A4 | A3 | A2 | GND
tDocu: REG